# Altium schematic sheet TNoiseWindow.schDOC: LiveDesign Evaluation - Video Windows
size A4; Organization: Altium Limited; Address1: L3, 12a Rodborough Rd; Address2: Frenchs Forest; Address3: NSW; Address4: Australia 2086; DocumentNumber: 13; SheetNumber: 13; SheetTotal: 20
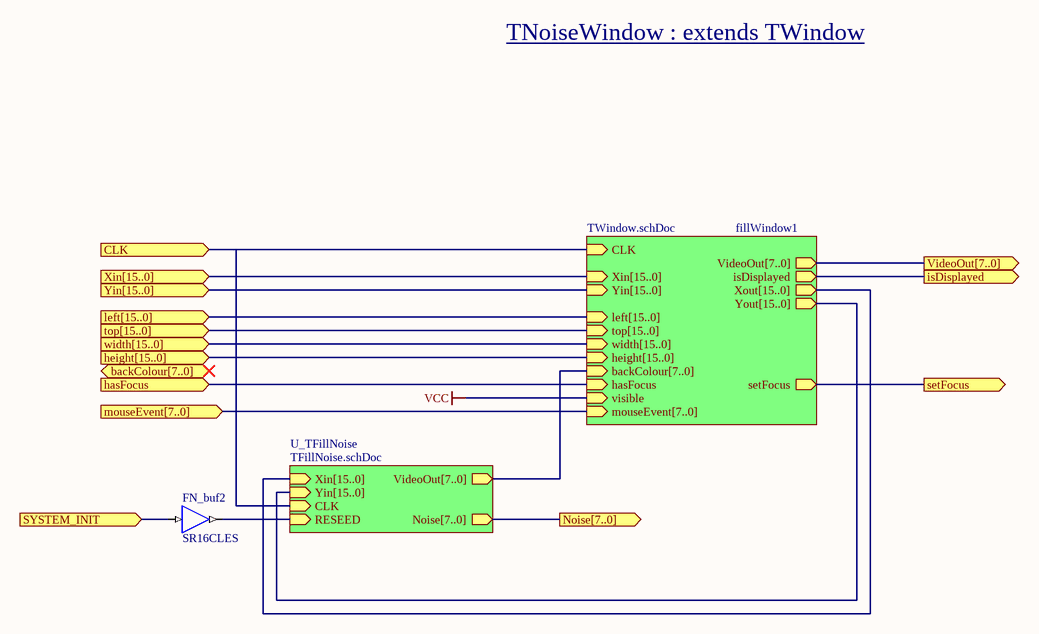
[diagram p0: TNoiseWindow.schDOC]

## Parts
FN_buf2  SR16CLES

## Sub-sheets
fillWindow1 = TWindow.schDoc: CLK (in), VideoOut[7..0] (out), Xin[15..0] (in), Yin[15..0] (in), top[15..0] (in), width[15..0] (in), height[15..0] (in), left[15..0] (in), Xout[15..0] (out), Yout[15..0] (out), backColour[7..0] (in), isDisplayed (out), visible (in), hasFocus (in), setFocus (out), mouseEvent[7..0] (in)
U_TFillNoise = TFillNoise.schDoc: Xin[15..0] (in), Yin[15..0] (in), VideoOut[7..0] (out), CLK (in), RESEED (in), Noise[7..0] (out)

## Ports
backColour[7..0] (in), CLK (in), hasFocus (in), height[15..0] (in), isDisplayed (out), left[15..0] (in), mouseEvent[7..0] (in), Noise[7..0] (out), setFocus (out), SYSTEM_INIT (in), top[15..0] (in), VideoOut[7..0] (out), width[15..0] (in), Xin[15..0] (in), Yin[15..0] (in)

## Nets
VCC: sheet fillWindow1/visible
CLK: port CLK, sheet fillWindow1/CLK, sheet U_TFillNoise/CLK
hasFocus: port hasFocus, sheet fillWindow1/hasFocus
isDisplayed: port isDisplayed, sheet fillWindow1/isDisplayed
setFocus: port setFocus, sheet fillWindow1/setFocus
SYSTEM_INIT: FN_buf2.I ; port SYSTEM_INIT
NetFN_buf2_O: FN_buf2.O ; sheet U_TFillNoise/RESEED

## Buses and harness runs
bus port height[15..0] = sheet fillWindow1/height[15..0]
bus port left[15..0] = sheet fillWindow1/left[15..0]
bus port mouseEvent[7..0] = sheet fillWindow1/mouseEvent[7..0]
bus port Noise[7..0] = sheet U_TFillNoise/Noise[7..0]
bus port top[15..0] = sheet fillWindow1/top[15..0]
bus port VideoOut[7..0] = sheet fillWindow1/VideoOut[7..0]
bus port width[15..0] = sheet fillWindow1/width[15..0]
bus port Xin[15..0] = sheet fillWindow1/Xin[15..0]
bus port Yin[15..0] = sheet fillWindow1/Yin[15..0]
bus sheet fillWindow1/backColour[7..0] = sheet U_TFillNoise/VideoOut[7..0]
bus sheet fillWindow1/Xout[15..0] = sheet U_TFillNoise/Xin[15..0]
bus sheet fillWindow1/Yout[15..0] = sheet U_TFillNoise/Yin[15..0]

## Notes on the sheet
- TNoiseWindow : extends TWindow
- Title
- Size:
- Date:
- A4
- Number:
- Time:
- Revision:
- Sheet
- of
- File:

## Library data of the parts
FN_buf2 = BUF: 1-bit General Purpose (Non-inverting) Buffer; ArchiveName: GENERIC; Published: 9-30-2003; Publisher: Altium Limited; Xilinx Equivalent: BUF; Core Revision: 1.00.00